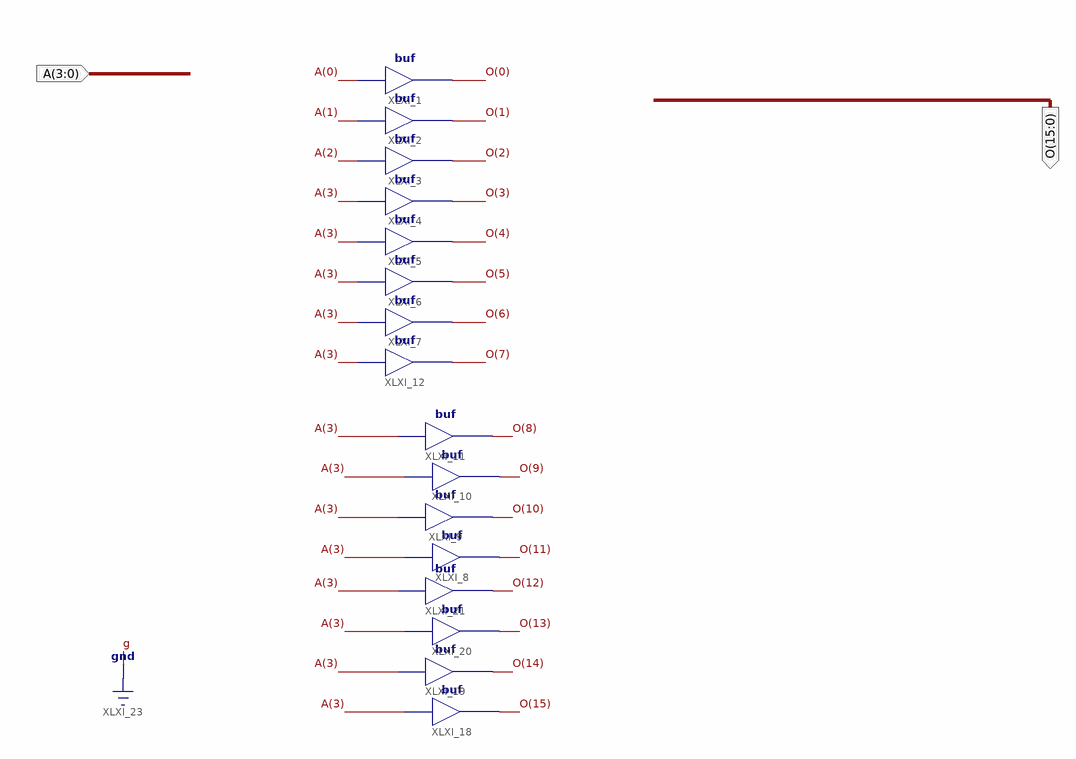
[diagram p0: schematic sheet 1]
// Xilinx ISE schematic SignExtend4_16.sch (spartan3e) as structural Verilog: 16 symbols, 2 ports
module SignExtend4_16 (
  input  [3:0] A,
  output [15:0] O
);

  buf XLXI_1 (O[0], A[0]);
  buf XLXI_2 (O[1], A[1]);
  buf XLXI_3 (O[2], A[2]);
  buf XLXI_4 (O[3], A[3]);
  buf XLXI_5 (O[4], A[3]);
  buf XLXI_6 (O[5], A[3]);
  buf XLXI_7 (O[6], A[3]);
  buf XLXI_8 (O[11], A[3]);
  buf XLXI_9 (O[10], A[3]);
  buf XLXI_10 (O[9], A[3]);
  buf XLXI_11 (O[8], A[3]);
  buf XLXI_12 (O[7], A[3]);
  buf XLXI_18 (O[15], A[3]);
  buf XLXI_19 (O[14], A[3]);
  buf XLXI_20 (O[13], A[3]);
  buf XLXI_21 (O[12], A[3]);
endmodule
